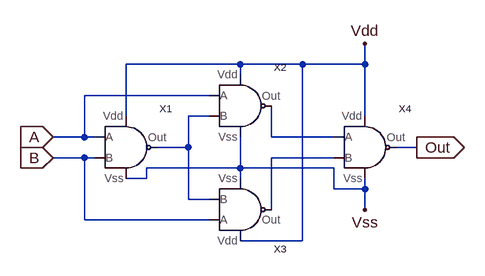
[diagram p0: schematic XOR.asc]
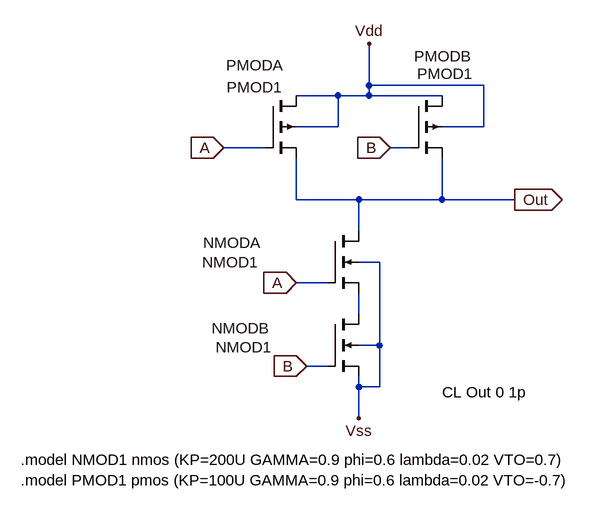
[diagram p1: sub-circuit nand.asc]
XOR.asc, the LTspice schematic file:
Version 4
SHEET 1 880 680
WIRE 352 0 176 0
WIRE 448 0 352 0
WIRE 544 0 544 -32
WIRE 544 0 448 0
WIRE 352 16 352 0
WIRE 304 48 112 48
WIRE 176 80 176 0
WIRE 304 80 272 80
WIRE 544 80 544 0
WIRE 112 112 112 48
WIRE 112 112 64 112
WIRE 128 112 112 112
WIRE 400 112 400 64
WIRE 496 112 400 112
WIRE 272 128 272 80
WIRE 272 128 224 128
WIRE 624 128 592 128
WIRE 112 144 64 144
WIRE 128 144 112 144
WIRE 496 144 400 144
WIRE 352 160 352 112
WIRE 352 160 208 160
WIRE 496 160 352 160
WIRE 208 176 208 160
WIRE 208 176 176 176
WIRE 352 176 352 160
WIRE 496 192 496 160
WIRE 544 192 544 176
WIRE 544 192 496 192
WIRE 272 208 272 128
WIRE 304 208 272 208
WIRE 400 224 400 144
WIRE 544 224 544 192
WIRE 112 240 112 144
WIRE 304 240 112 240
WIRE 448 272 448 0
WIRE 448 272 352 272
FLAG 64 112 A
IOPIN 64 112 In
FLAG 64 144 B
IOPIN 64 144 In
FLAG 624 128 Out
IOPIN 624 128 Out
FLAG 544 -32 Vdd
FLAG 544 224 Vss
SYMBOL NAND 144 128 R0
SYMATTR InstName X1
SYMBOL NAND 320 64 R0
SYMATTR InstName X2
SYMBOL NAND 320 224 M180
SYMATTR InstName X3
SYMBOL NAND 512 128 R0
SYMATTR InstName X4

nand.asc, the sub-circuit schematic file:
Version 4
SHEET 1 880 680
WIRE 336 -112 336 -176
WIRE 512 -112 336 -112
WIRE 288 -96 224 -96
WIRE 336 -96 336 -112
WIRE 336 -96 288 -96
WIRE 448 -96 336 -96
WIRE 288 -48 288 -96
WIRE 288 -48 224 -48
WIRE 512 -48 512 -112
WIRE 512 -48 448 -48
WIRE 176 -16 112 -16
WIRE 400 -16 368 -16
WIRE 224 64 224 0
WIRE 320 64 224 64
WIRE 448 64 448 0
WIRE 448 64 320 64
WIRE 560 64 448 64
WIRE 320 112 320 64
WIRE 352 160 320 160
WIRE 272 192 224 192
WIRE 320 240 320 208
WIRE 352 288 352 160
WIRE 352 288 320 288
WIRE 272 320 240 320
WIRE 320 352 320 336
WIRE 352 352 352 288
WIRE 352 352 320 352
WIRE 320 400 320 352
FLAG 112 -16 A
IOPIN 112 -16 In
FLAG 224 192 A
IOPIN 224 192 In
FLAG 368 -16 B
IOPIN 368 -16 In
FLAG 240 320 B
IOPIN 240 320 In
FLAG 560 64 Out
IOPIN 560 64 Out
FLAG 320 400 Vss
FLAG 336 -176 Vdd
SYMBOL pmos4 176 -96 R0
WINDOW 0 -60 -47 Left 2
WINDOW 3 -59 -13 Left 2
SYMATTR InstName PMODA
SYMATTR Value PMOD1
SYMATTR Value2 l=1u w=50u
SYMBOL pmos4 400 -96 R0
WINDOW 0 5 -61 Left 2
WINDOW 3 10 -34 Left 2
SYMATTR InstName PMODB
SYMATTR Value PMOD1
SYMATTR Value2 l=1u w=50u
SYMBOL nmos4 272 112 R0
WINDOW 0 -191 18 Left 2
WINDOW 3 -193 48 Left 2
SYMATTR InstName NMODA
SYMATTR Value NMOD1
SYMATTR Value2 l=1u w=50u
SYMBOL nmos4 272 240 R0
WINDOW 0 -178 22 Left 2
WINDOW 3 -172 51 Left 2
SYMATTR InstName NMODB
SYMATTR Value NMOD1
SYMATTR Value2 l=1u w=100u
TEXT -200 464 Left 2 !.model NMOD1 nmos (KP=200U GAMMA=0.9 phi=0.6 lambda=0.02 VTO=0.7)
TEXT -200 496 Left 2 !.model PMOD1 pmos (KP=100U GAMMA=0.9 phi=0.6 lambda=0.02 VTO=-0.7)
TEXT 448 360 Left 2 !CL Out 0 1p

The netlist it stands for:
* XOR.asc
XX1 A B N001 Vss Vdd nand
XX2 A N001 N002 Vss Vdd nand
XX3 B N001 N003 Vss Vdd nand
XX4 N002 N003 Out Vss Vdd nand

* block symbol definitions
.subckt nand A B Out Vss Vdd
M§PMODA Vdd A Out Vdd PMOD1 l=1u w=50u
M§PMODB Vdd B Out Vdd PMOD1 l=1u w=50u
M§NMODA Out A N001 Vss NMOD1 l=1u w=50u
M§NMODB N001 B Vss Vss NMOD1 l=1u w=100u
.model NMOD1 nmos (KP=200U GAMMA=0.9 phi=0.6 lambda=0.02 VTO=0.7)
.model PMOD1 pmos (KP=100U GAMMA=0.9 phi=0.6 lambda=0.02 VTO=-0.7)
CL Out 0 1p
.ends nand

.model NMOS NMOS
.model PMOS PMOS
.lib standard.mos
.backanno
.end